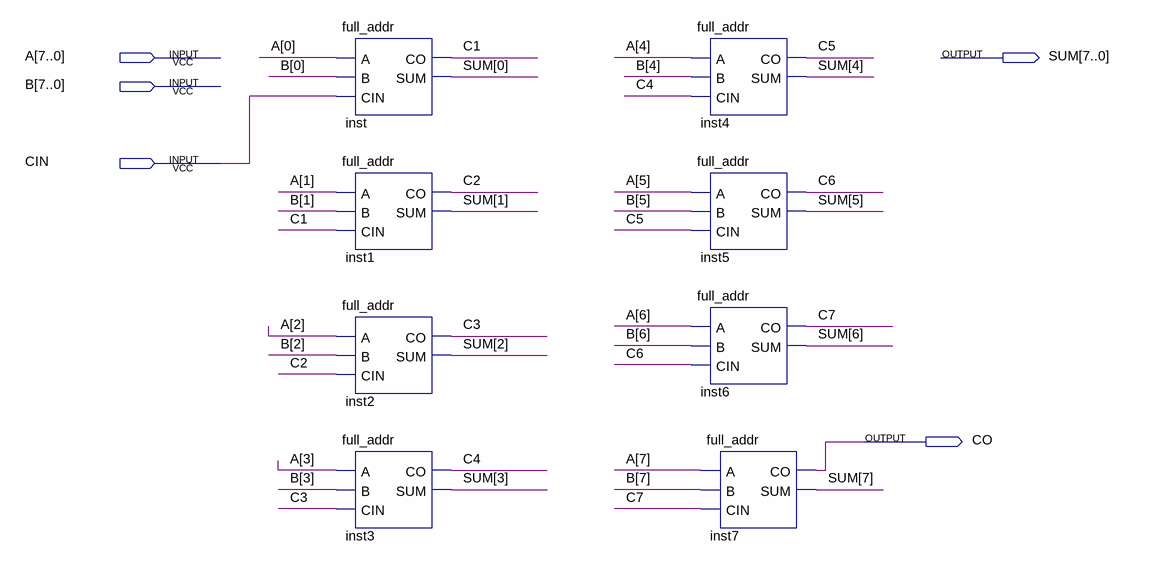
[diagram p0: schematic sheet]
// Quartus schematic m_faddr8.bdf as structural Verilog: 8 symbols, 5 pins
module m_faddr8 (
  input  [7:0] A,
  input  [7:0] B,
  input  CIN,
  output [7:0] SUM,
  output CO
);

  wire C1, C2, C3, C4, C5, C6, C7;

  full_addr inst (.A(A[0]), .B(B[0]), .CIN(CIN), .CO(C1), .SUM(SUM[0]));
  full_addr inst1 (.A(A[1]), .B(B[1]), .CIN(C1), .CO(C2), .SUM(SUM[1]));
  full_addr inst2 (.A(A[2]), .B(B[2]), .CIN(C2), .CO(C3), .SUM(SUM[2]));
  full_addr inst3 (.A(A[3]), .B(B[3]), .CIN(C3), .CO(C4), .SUM(SUM[3]));
  full_addr inst4 (.A(A[4]), .B(B[4]), .CIN(C4), .CO(C5), .SUM(SUM[4]));
  full_addr inst5 (.A(A[5]), .B(B[5]), .CIN(C5), .CO(C6), .SUM(SUM[5]));
  full_addr inst6 (.A(A[6]), .B(B[6]), .CIN(C6), .CO(C7), .SUM(SUM[6]));
  full_addr inst7 (.A(A[7]), .B(B[7]), .CIN(C7), .CO(CO), .SUM(SUM[7]));
endmodule
